# EAGLE design blink (EAGLE 6.6.0)
AUTHOR: Brad Campbell; REV: A; TITLE: Blink
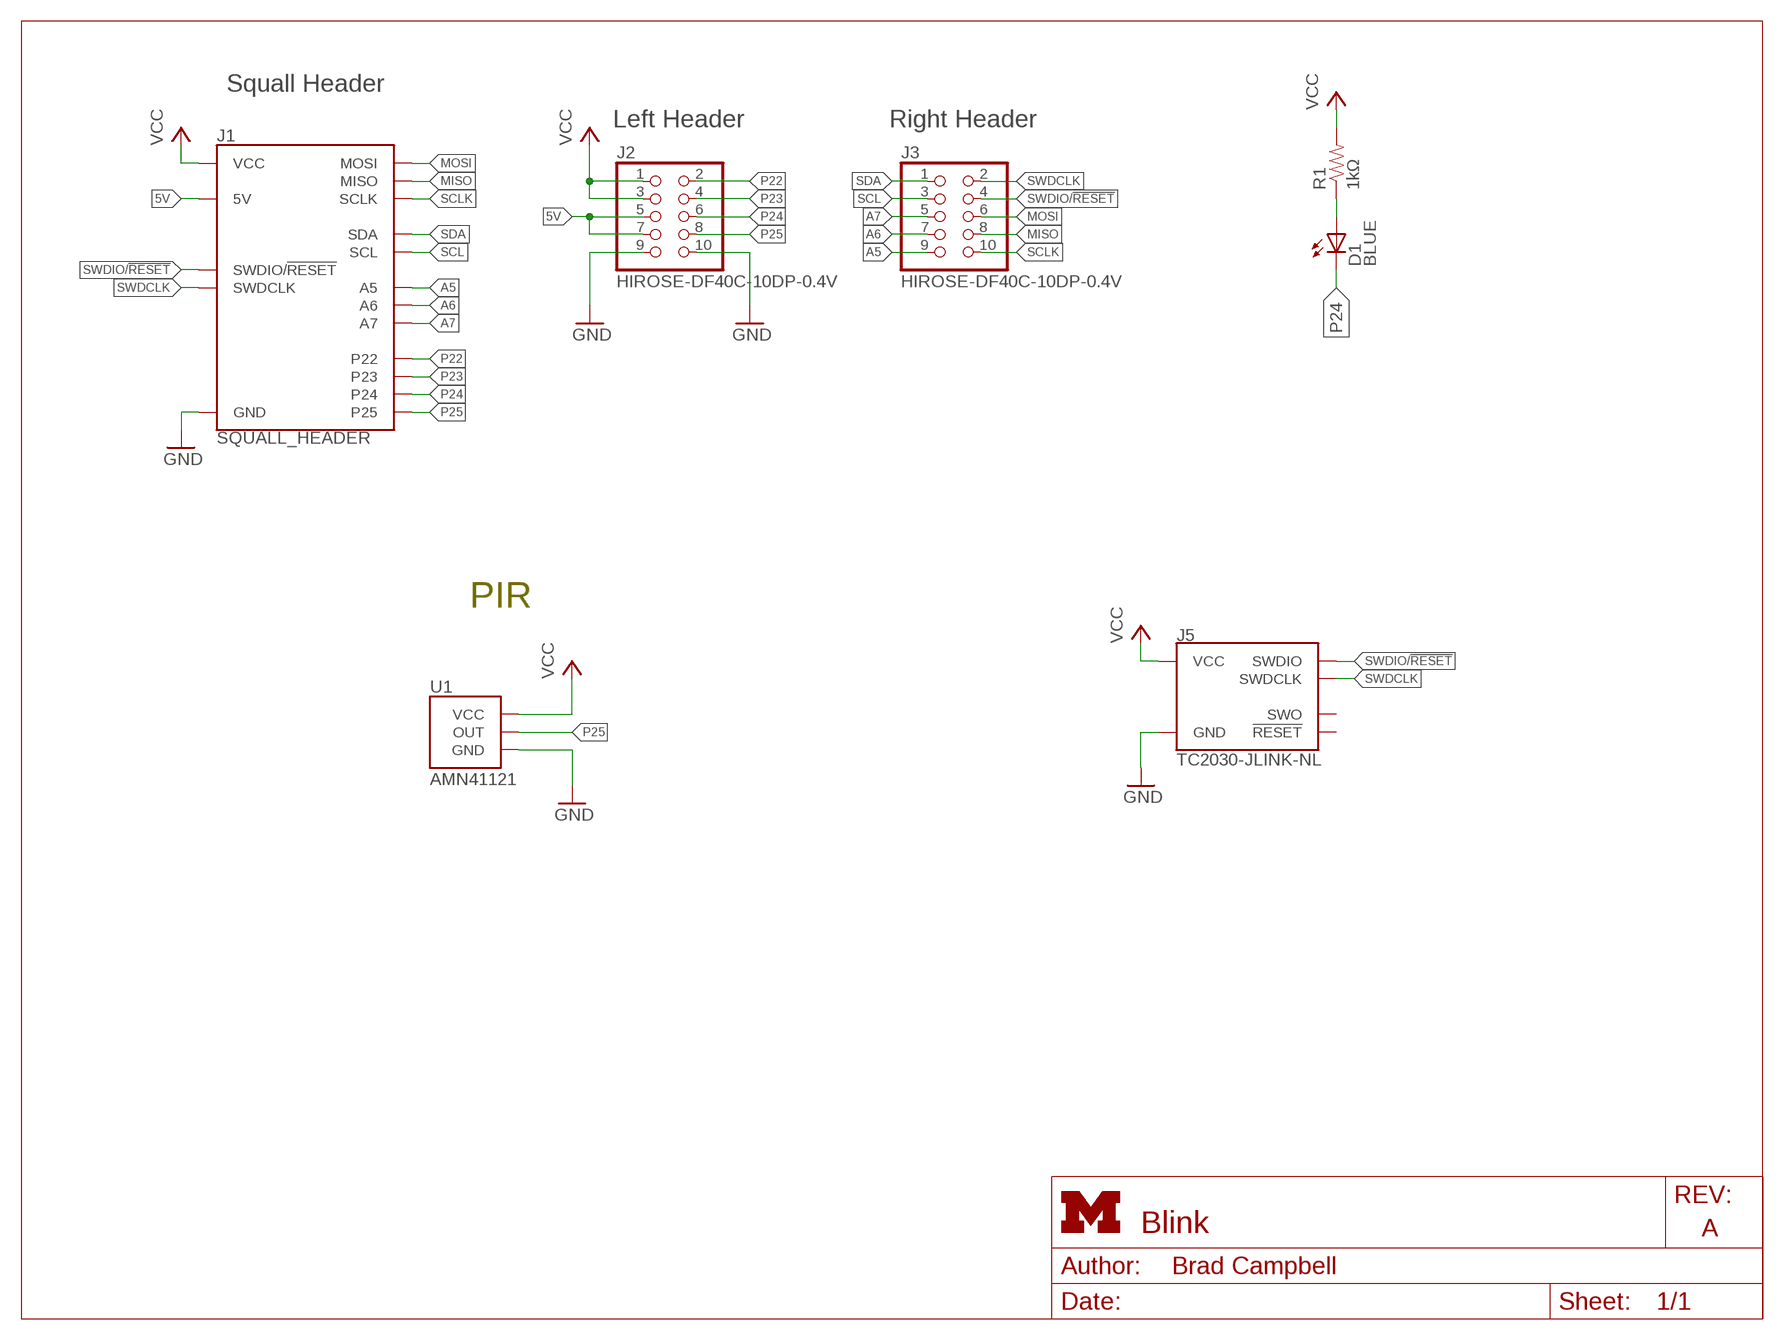
[diagram p0: schematic, sheet 1]
FRAME1 (LETTER_L): HEIGHT: 8.5in; WIDTH: 11in

## Parts
D1  BLUE  LED0603  [LED-0603]
J1  SQUALL_HEADER  [SQUALL_HEADER]
J2  HIROSE-DF40C-10DP-0.4V  [2X5/SMD/0.4MM]
J3  HIROSE-DF40C-10DP-0.4V  [2X5/SMD/0.4MM]
J5  TC2030-JLINK-NL  [TC2030-IDC-NL]
R1  1kΩ  RESISTOR0402_RES  [0402_RES]
U1  AMN41121  [AMN2]

## Nets
5V: J1.A5(5V) J1.A7(5V) J2.5 J2.7
A5: J1.B9(A5) J3.9
A6: J1.B7(A6) J3.7
A7: J1.B5(A7) J3.5
GND: J1.A9(GND) J1.A10(GND) J2.9 J2.10 J5.5(GND) U1.GND
MISO: J1.B8(MISO) J3.8
MOSI: J1.B6(MOSI) J3.6
N$2: D1.A R1.1
P22: J1.A2(P22) J2.2
P23: J1.A4(P23) J2.4
P24: D1.C J1.A6(P24) J2.6
P25: J1.A8(P25) J2.8 U1.OUT
SCL: J1.B3(SCL) J3.3
SCLK: J1.B10(SCLK) J3.10
SDA: J1.B1(SDA) J3.1
SWDCLK: J1.B2(SWDCLK) J3.2 J5.4(SWDCLK)
SWDIO/!RESET: J1.B4(SWDIO/!RESET) J3.4 J5.2(SWDIO)
VCC: J1.A1(VCC) J1.A3(VCC) J2.1 J2.3 J5.1(VCC) R1.2 U1.VCC
Unconnected: J5.3(!RESET) J5.6(SWO)

## Notes on the sheet
- Squall Header
- Left Header | Right Header
- PIR

## Library data of the parts
D1 = SparkFun-LED:LED: LEDs Standard schematic elements and footprints for 5mm, 3mm, 1206, and 0603 sized LEDs. 5mm - Spark Fun Electronics SKU : COM-00529 (and others)
J1 = squall:SQUALL_HEADER: Header for a sensor board on top of the Squall BLE tag board. Requires two DF40C-10DS-0.4V(51).; DIGIKEY: H11617CT-ND
J2 J3 = headers:HIROSE-DF40C-10DP-0.4V: DF40 Series Header - 0.4MM Pitch; DIGIKEY: H11616CT-ND; MOUSER: 798-DF40C10DP0.4V51; NEWARK: 68X2585
J5 = connector:TC2030-JLINK
R1 = passives:RESISTOR: Resistor Basic schematic elements and footprints for 0603, 1206, and PTH resistors.
U1 = chips:AMN: Passive infrared human detection sensor with built-in amp.; DIGIKEY: 255-3065-ND

## Board
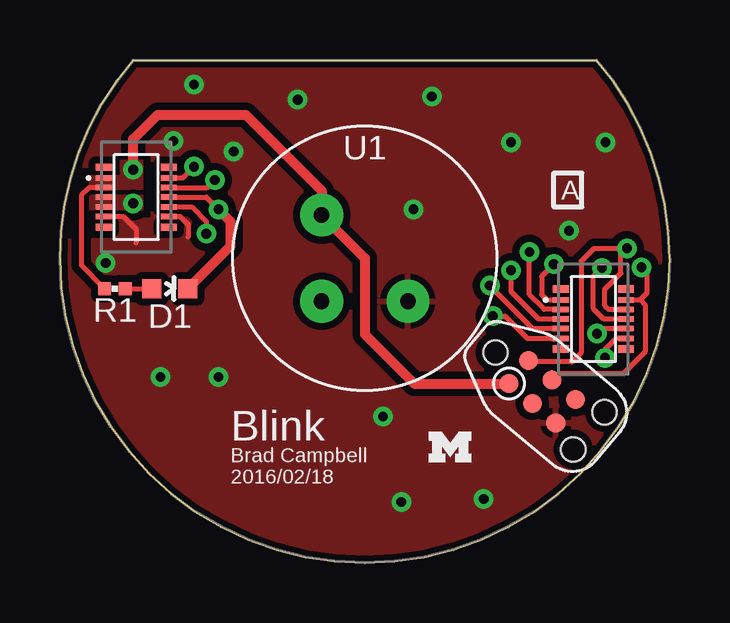
[diagram p1: board, top side]
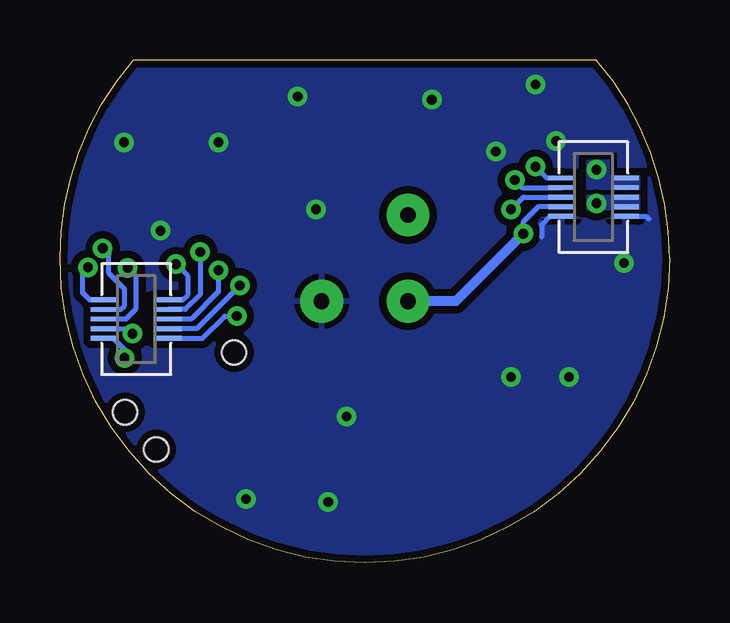
[diagram p2: board, bottom side, seen from below]

Size 25.4 x 20.95 mm. Coordinates in mm from the lower left corner, seen from the top.
Outline: 3.05,20.95 22.35,20.95 arc-41 25.4,12.7 arc-180 0,12.7 arc-41 3.05,20.95
Copper layers (1*16): Top 0.0178mm / dielectric 59mil / Bottom 0.0178mm
Design rules "sunstone-2lyr_v1.0.0.3 *": minimum track width 6mil, minimum drill 14mil, track to track 6mil, track to pad 6mil, pad to pad 6mil, via to via 6mil, smd to smd 6mil, copper to edge 10mil, drill to drill 16mil, minimum pad ring 8mil, minimum via ring 8mil, stop-mask expansion 3mil, vias tented up to drill 50mil, thermal gap 10mil

### Footprints (pad centres in the part's own frame; a part is rotated, then mirrored left to right if it is on the bottom)
LED-0603 = smd 0.8 x 0.8: A 0,-0.75; C 0,0.75
SQUALL_HEADER = smd 1.14 x 0.2 bottom: A1 -10.845,3.34; A2 -8.205,3.34; A3 -10.845,2.94; A4 -8.205,2.94; A5 -10.845,2.54; A6 -8.205,2.54; A7 -10.845,2.14; A8 -8.205,2.14; A9 -10.845,1.74; A10 -8.205,1.74; B1 8.205,-1.74; B2 10.845,-1.74; B3 8.205,-2.14; B4 10.845,-2.14; B5 8.205,-2.54; B6 10.845,-2.54; B7 8.205,-2.94; B8 10.845,-2.94; B9 8.205,-3.34; B10 10.845,-3.34
2X5/SMD/0.4MM = smd 0.66 x 0.23: 1 -1.355,0.8; 2 1.355,0.8; 3 -1.355,0.4; 4 1.355,0.4; 5 -1.355,0; 6 1.355,0; 7 -1.355,-0.4; 8 1.355,-0.4; 9 -1.355,-0.8; 10 1.355,-0.8 | smd 0.66 x 0.3: A -1.355,1.25; B 1.355,1.25; C -1.355,-1.25; D 1.355,-1.25
TC2030-IDC-NL = smd 0.787 x 0.787: 1 -1.27,-0.635; 2 -1.27,0.635; 3 0,-0.635; 4 0,0.635; 5 1.27,-0.635; 6 1.27,0.635 | hole 1.016: -2.54,0; 2.54,1.016; 2.54,-1.016
0402_RES = smd 0.536 x 0.546: 1 -0.433,0; 2 0.433,0
AMN2 = drill 0.65 pad 1.778: GND 1.796,-1.796; OUT -1.796,-1.796; VCC -1.796,1.796

### Placement (x,y rotation side)
D1  4.57,11.43 270 top
J1  12.7,12.7 0 top
J2  3.17,15.24 0 top
J3  22.23,10.16 0 top
J5  20.09,7.14 320 top
R1  2.29,11.43 180 top
U1  12.7,12.7 0 top
U$1  [UMICH_SOLID_50MIL]  16.26,4.83 0 top

### Tracks (layer width: path | path; a pad name or v marks a point on that pad's centre or on a via)
5V  (via drill 0.41)
  other vias: 3.05,14.99
  pour Top (no thermals): 1.27,15.29 1.27,14.73 3.43,14.73 3.43,15.29
  pour Bottom (no thermals): 1.27,15.29 1.27,14.73 3.43,14.73 3.43,15.29
A5  (via drill 0.41)
  Top 0.203: v18.03,10.29 18.54,10.29 19.47,9.36 J3.9
  Bottom 0.203: J1.B9 19.47,9.36 18.54,10.29 v18.03,10.29
A6  (via drill 0.41)
  Top 0.203: J3.7 19.7,9.76 v17.91,11.56
  Bottom 0.203: J1.B7 19.7,9.76 v17.91,11.56
A7  (via drill 0.41)
  Top 0.203: J3.5 19.94,10.16 18.8,11.3 v18.8,12.19
  Bottom 0.203: v18.8,12.19 18.8,11.3 19.94,10.16 J1.B5
GND  (via drill 0.41)
  Top 0.203: J2.10 4.99,14.44 5.33,14.1 5.33,13.59 | J2.9 2.63,14.44 3.17,13.89 3.17,13.33
  Bottom 0.203: J1.A10 4.99,14.44 5.33,14.1 5.33,13.59 | J1.A9 0.98,14.44 0.86,14.33
  other vias: 4.72,17.58 1.9,12.5 9.91,19.3 15.49,19.43 18.8,17.53 22.73,17.53 17.65,2.67 14.22,2.54 6.6,7.75 4.19,7.75 14.73,14.73 5.59,19.94 7.24,17.14 21.21,13.84 13.46,6.1
  pour Top (isolate 0.305, rank 2): 25.4,12.7 arc-180 0,12.7 arc-41 3.05,20.95 22.35,20.95 arc-41
  pour Bottom (isolate 0.305, rank 2): 25.4,12.7 arc-180 0,12.7 arc-41 3.05,20.95 22.35,20.95 arc-41
MISO  (via drill 0.41)
  Top 0.203: J3.8 22.59,9.76 v22.38,9.55
  Bottom 0.203: J1.B8 22.59,9.76 v22.38,9.55
MOSI  (via drill 0.41)
  Top 0.203: J3.6 22.66,10.16 22.23,10.59 22.23,11.94 v22.58,12.29
  Bottom 0.203: J1.B6 22.66,10.16 22.23,10.59 22.23,11.94 v22.58,12.29
N$2
  Top 0.203: R1.1 D1.A
P22  (via drill 0.41)
  Top 0.203: J2.2 5.12,16.04 v5.59,16.51
  Bottom 0.203: v5.59,16.51 5.12,16.04 J1.A2
P23  (via drill 0.41)
  Top 0.203: J2.4 6.14,15.64 v6.45,15.95
  Bottom 0.203: v6.45,15.95 6.14,15.64 J1.A4
P24  (via drill 0.41)
  Top 0.203: J2.6 6.1,15.24 v6.6,14.73
  Top 0.406: D1.C 7.11,13.22 7.11,14.22 v6.6,14.73
  Bottom 0.203: v6.6,14.73 6.1,15.24 J1.A6
P25  (via drill 0.41)
  Top 0.203: J2.8 5.48,14.84 6.1,14.22 v6.1,13.72
  Bottom 0.203: J1.A8 5.48,14.84 6.1,14.22 v6.1,13.72
  Bottom 0.406: v6.1,13.72 8.91,10.9 U1.OUT
SCL  (via drill 0.41)
  Top 0.203: J3.3 20.17,10.56 19.56,11.18 v19.56,12.95
  Bottom 0.203: v19.56,12.95 19.56,11.18 20.17,10.56 J1.B3
SCLK  (via drill 0.41)
  Top 0.203: J3.10 23.18,9.36 22.71,8.89 v22.71,8.55
  Bottom 0.203: J1.B10 23.18,9.36 22.71,8.89 v22.71,8.55
SDA  (via drill 0.41)
  Top 0.203: v20.57,12.45 20.07,11.94 20.07,11.18 20.28,10.96 J3.1
  Bottom 0.203: J1.B1 20.28,10.96 20.07,11.18 20.07,11.94 v20.57,12.45
SWDCLK  (via drill 0.41)
  Top 0.203: J3.2 24.17,10.96 | 24.17,10.96 24.46,11.25 24.46,12.09 v24.23,12.32 | 24.17,10.96 24.38,10.74 24.38,8.8 23.47,7.89 20.76,7.89 J5.4
  Bottom 0.203: J1.B2 24.17,10.96 24.46,11.25 24.46,12.09 v24.23,12.32
SWDIO/!RESET  (via drill 0.41)
  Top 0.203: J3.4 22.86,10.57 22.71,10.72 22.71,11.4 23.37,12.06 23.37,12.85 v23.62,13.11 22.25,13.11 21.72,12.57 21.72,8.76 21.34,8.38 19.59,8.38 J5.2
  Bottom 0.203: J1.B4 22.87,10.56 22.71,10.72 22.71,11.4 23.37,12.06 23.37,12.85 v23.62,13.11
VCC  (via drill 0.41)
  Top 0.203: J2.3 1.21,15.64 0.89,15.32 0.89,12.39 R1.2
  Top 0.406: v3.05,16.38 3.05,17.65 4.06,18.67 7.75,18.67 10.9,15.51 U1.VCC 12.7,12.7 12.7,9.52 14.76,7.47 J5.1
  Bottom 0.203: J1.A3 J2.3
  pour Bottom (no thermals): 1.27,16.1 2.54,16.1 2.54,16.76 3.43,16.76 3.43,15.6 1.27,15.6
  pour Top (no thermals): 1.27,15.6 1.27,16.1 2.54,16.1 2.54,16.76 3.43,16.76 3.43,15.6

### Text on the board
tPlace: A | Blink | 2016/02/18 | Brad Campbell